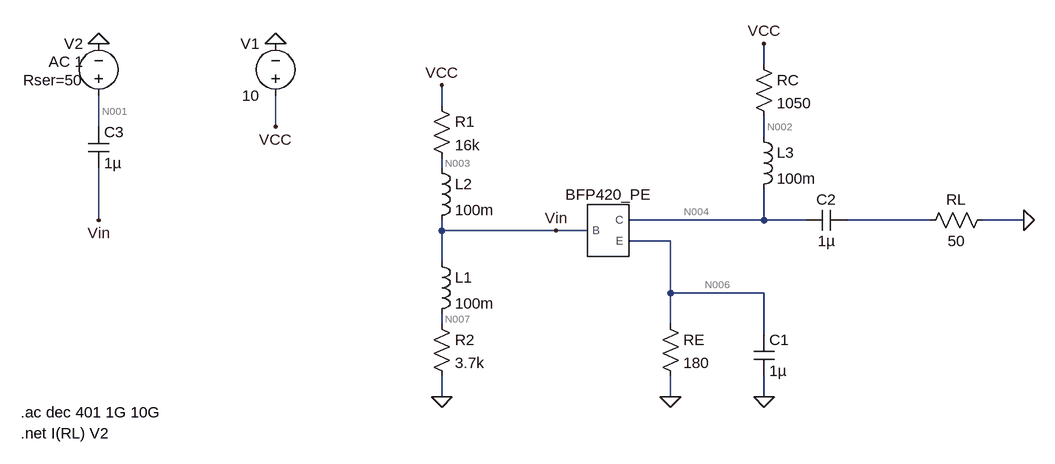
[diagram p0: schematic LNA.asc]
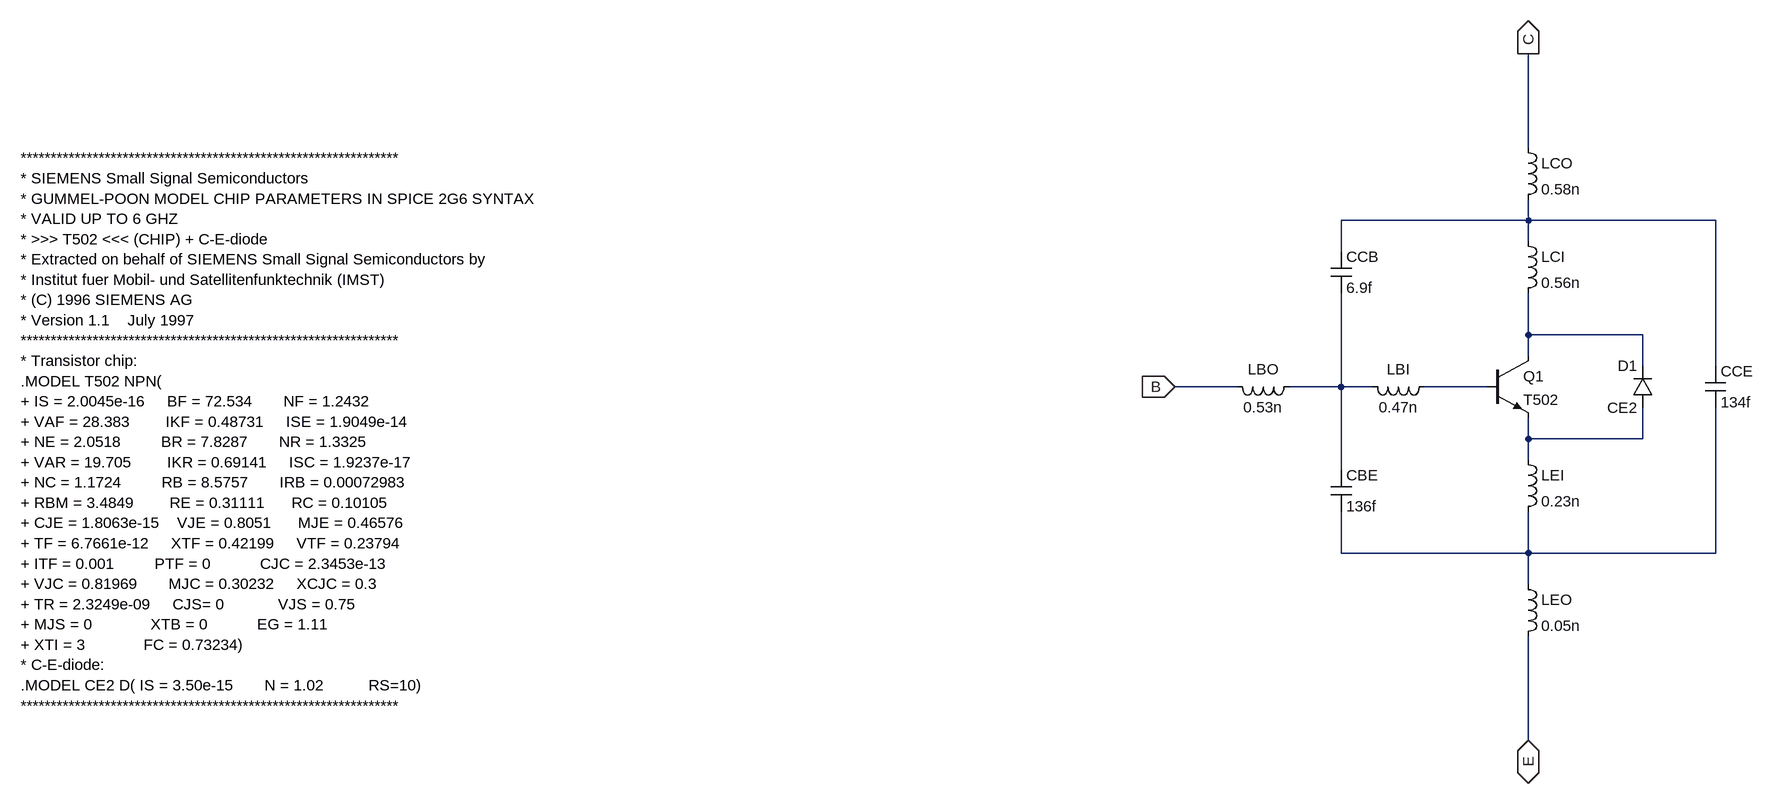
[diagram p1: sub-circuit transistor.asc]
LNA.asc, the LTspice schematic file:
Version 4.1
SHEET 1 1028 680
WIRE 496 -96 496 -128
WIRE 0 -32 0 -64
WIRE -528 0 -528 -48
WIRE -256 0 -256 -48
WIRE 496 16 496 -16
WIRE 0 64 0 48
WIRE -528 144 -528 64
WIRE 496 144 496 96
WIRE 496 144 288 144
WIRE 560 144 496 144
WIRE 752 144 624 144
WIRE 896 144 832 144
WIRE 0 160 0 144
WIRE 176 160 0 160
WIRE 224 160 176 160
WIRE 352 176 288 176
WIRE 0 208 0 160
WIRE 352 256 352 176
WIRE 496 256 352 256
WIRE 0 304 0 288
WIRE 352 304 352 256
WIRE 496 320 496 256
WIRE 0 416 0 384
WIRE 352 416 352 384
WIRE 496 416 496 384
FLAG -256 -128 0
FLAG 0 416 0
FLAG 352 416 0
FLAG -256 0 VCC
FLAG 0 -64 VCC
FLAG 496 -128 VCC
FLAG 496 416 0
FLAG 896 144 0
FLAG -528 -128 0
FLAG -528 144 Vin
FLAG 176 160 Vin
SYMBOL res 480 -112 R0
SYMATTR InstName RC
SYMATTR Value 1050
SYMBOL res 336 288 R0
SYMATTR InstName RE
SYMATTR Value 180
SYMBOL res -16 288 R0
SYMATTR InstName R2
SYMATTR Value 3.7k
SYMBOL res -16 -48 R0
SYMATTR InstName R1
SYMATTR Value 16k
SYMBOL voltage -256 -32 R180
WINDOW 0 24 96 Left 2
WINDOW 3 24 16 Left 2
WINDOW 123 0 0 Left 0
WINDOW 39 0 0 Left 0
SYMATTR InstName V1
SYMATTR Value 10
SYMBOL transistor 256 160 R0
SYMATTR InstName BFP420_PE
SYMBOL cap 480 320 R0
SYMATTR InstName C1
SYMATTR Value 1µ
SYMBOL ind -16 192 R0
SYMATTR InstName L1
SYMATTR Value 100m
SYMBOL ind -16 48 R0
SYMATTR InstName L2
SYMATTR Value 100m
SYMBOL ind 480 0 R0
SYMATTR InstName L3
SYMATTR Value 100m
SYMBOL res 848 128 R90
WINDOW 0 0 56 VBottom 2
WINDOW 3 32 56 VTop 2
SYMATTR InstName RL
SYMATTR Value 50
SYMBOL cap 624 128 R90
WINDOW 0 0 32 VBottom 2
WINDOW 3 32 32 VTop 2
SYMATTR InstName C2
SYMATTR Value 1µ
SYMBOL voltage -528 -32 R180
WINDOW 0 24 96 Left 2
WINDOW 3 24 16 Left 2
WINDOW 123 24 68 Left 2
WINDOW 39 24 40 Left 2
SYMATTR InstName V2
SYMATTR Value ""
SYMATTR Value2 AC 1
SYMATTR SpiceLine Rser=50
SYMBOL cap -544 0 R0
SYMATTR InstName C3
SYMATTR Value 1µ
TEXT -648 440 Left 2 !.ac dec 401 1G 10G
TEXT -648 472 Left 2 !.net I(RL) V2

transistor.asc, the sub-circuit schematic file:
Version 4.1
SHEET 1 2192 680
WIRE 1840 -416 1840 -560
WIRE 1840 -304 1840 -336
WIRE 1840 -304 1552 -304
WIRE 2128 -304 1840 -304
WIRE 1840 -272 1840 -304
WIRE 1552 -256 1552 -304
WIRE 1840 -128 1840 -192
WIRE 2016 -128 1840 -128
WIRE 1840 -96 1840 -128
WIRE 2016 -80 2016 -128
WIRE 2128 -80 2128 -304
WIRE 1392 -48 1296 -48
WIRE 1552 -48 1552 -192
WIRE 1552 -48 1472 -48
WIRE 1600 -48 1552 -48
WIRE 1776 -48 1680 -48
WIRE 1840 32 1840 0
WIRE 2016 32 2016 -16
WIRE 2016 32 1840 32
WIRE 1840 64 1840 32
WIRE 1552 80 1552 -48
WIRE 1552 208 1552 144
WIRE 1840 208 1840 144
WIRE 1840 208 1552 208
WIRE 2128 208 2128 -16
WIRE 2128 208 1840 208
WIRE 1840 256 1840 208
WIRE 1840 496 1840 336
FLAG 1840 496 E
IOPIN 1840 496 BiDir
FLAG 1296 -48 B
IOPIN 1296 -48 In
FLAG 1840 -560 C
IOPIN 1840 -560 Out
SYMBOL npn 1776 -96 R0
SYMATTR InstName Q1
SYMATTR Value T502
SYMBOL ind 1824 48 R0
SYMATTR InstName LEI
SYMATTR Value 0.23n
SYMBOL ind 1824 240 R0
SYMATTR InstName LEO
SYMATTR Value 0.05n
SYMBOL ind 1824 -288 R0
SYMATTR InstName LCI
SYMATTR Value 0.56n
SYMBOL ind 1824 -432 R0
SYMATTR InstName LCO
SYMATTR Value 0.58n
SYMBOL ind 1696 -64 R90
WINDOW 0 5 56 VBottom 2
WINDOW 3 32 56 VTop 2
SYMATTR InstName LBI
SYMATTR Value 0.47n
SYMBOL ind 1488 -64 R90
WINDOW 0 5 56 VBottom 2
WINDOW 3 32 56 VTop 2
SYMATTR InstName LBO
SYMATTR Value 0.53n
SYMBOL cap 2112 -80 R0
SYMATTR InstName CCE
SYMATTR Value 134f
SYMBOL cap 1536 -256 R0
SYMATTR InstName CCB
SYMATTR Value 6.9f
SYMBOL cap 1536 80 R0
SYMATTR InstName CBE
SYMATTR Value 136f
SYMBOL diode 2032 -16 R180
WINDOW 0 24 64 Left 2
WINDOW 3 24 0 Left 2
SYMATTR InstName D1
SYMATTR Value CE2
TEXT -480 -400 Left 2 !***************************************************************\n* SIEMENS Small Signal Semiconductors\n* GUMMEL-POON MODEL CHIP PARAMETERS IN SPICE 2G6 SYNTAX\n* VALID UP TO 6 GHZ\n* >>> T502 <<< (CHIP) + C-E-diode\n* Extracted on behalf of SIEMENS Small Signal Semiconductors by\n* Institut fuer Mobil- und Satellitenfunktechnik (IMST)\n* (C) 1996 SIEMENS AG\n* Version 1.1    July 1997\n***************************************************************\n* Transistor chip:\n.MODEL T502 NPN(\n+ IS = 2.0045e-16     BF = 72.534       NF = 1.2432\n+ VAF = 28.383        IKF = 0.48731     ISE = 1.9049e-14\n+ NE = 2.0518         BR = 7.8287       NR = 1.3325\n+ VAR = 19.705        IKR = 0.69141     ISC = 1.9237e-17\n+ NC = 1.1724         RB = 8.5757       IRB = 0.00072983\n+ RBM = 3.4849        RE = 0.31111      RC = 0.10105\n+ CJE = 1.8063e-15    VJE = 0.8051      MJE = 0.46576\n+ TF = 6.7661e-12     XTF = 0.42199     VTF = 0.23794\n+ ITF = 0.001         PTF = 0           CJC = 2.3453e-13\n+ VJC = 0.81969       MJC = 0.30232     XCJC = 0.3\n+ TR = 2.3249e-09     CJS= 0            VJS = 0.75\n+ MJS = 0             XTB = 0           EG = 1.11\n+ XTI = 3             FC = 0.73234)\n* C-E-diode:\n.MODEL CE2 D( IS = 3.50e-15       N = 1.02          RS=10)\n***************************************************************

The netlist it stands for:
* LNA.asc
RC VCC N002 1050
RE N006 0 180
R2 N007 0 3.7k
R1 VCC N003 16k
V1 VCC 0 10
X§BFP420_PE Vin N004 N006 transistor
C1 N006 0 1µ
L1 Vin N007 100m
L2 N003 Vin 100m
L3 N002 N004 100m
RL 0 N005 50
C2 N005 N004 1µ
V2 N001 0 AC 1 Rser=50
C3 N001 Vin 1µ

* block symbol definitions
.subckt transistor B C E
Q1 N002 N004 N005 0 T502
LEI N005 N006 0.23n
LEO N006 E 0.05n
LCI N001 N002 0.56n
LCO C N001 0.58n
LBI N004 N003 0.47n
LBO N003 B 0.53n
CCE N001 N006 134f
CCB N001 N003 6.9f
CBE N003 N006 136f
D1 N005 N002 CE2
***************************************************************
* SIEMENS Small Signal Semiconductors
* GUMMEL-POON MODEL CHIP PARAMETERS IN SPICE 2G6 SYNTAX
* VALID UP TO 6 GHZ
* >>> T502 <<< (CHIP) + C-E-diode
* Extracted on behalf of SIEMENS Small Signal Semiconductors by
* Institut fuer Mobil- und Satellitenfunktechnik (IMST)
* (C) 1996 SIEMENS AG
* Version 1.1    July 1997
***************************************************************
* Transistor chip:
.MODEL T502 NPN(
+ IS = 2.0045e-16     BF = 72.534       NF = 1.2432
+ VAF = 28.383        IKF = 0.48731     ISE = 1.9049e-14
+ NE = 2.0518         BR = 7.8287       NR = 1.3325
+ VAR = 19.705        IKR = 0.69141     ISC = 1.9237e-17
+ NC = 1.1724         RB = 8.5757       IRB = 0.00072983
+ RBM = 3.4849        RE = 0.31111      RC = 0.10105
+ CJE = 1.8063e-15    VJE = 0.8051      MJE = 0.46576
+ TF = 6.7661e-12     XTF = 0.42199     VTF = 0.23794
+ ITF = 0.001         PTF = 0           CJC = 2.3453e-13
+ VJC = 0.81969       MJC = 0.30232     XCJC = 0.3
+ TR = 2.3249e-09     CJS= 0            VJS = 0.75
+ MJS = 0             XTB = 0           EG = 1.11
+ XTI = 3             FC = 0.73234)
* C-E-diode:
.MODEL CE2 D( IS = 3.50e-15       N = 1.02          RS=10)
***************************************************************
.ends transistor

.model D D
.lib standard.dio
.model NPN NPN
.model PNP PNP
.lib standard.bjt
.ac dec 401 1G 10G
.net I(RL) V2
.backanno
.end

* Results of the author's LTspice run, read from the files saved beside the schematic
* Operating Point, zero values left out:
*   V(n002) = 5.773 V
*   V(n003) = 1.718 V
*   V(n004) = 5.773 V
*   V(n006) = 734.2 mV
*   V(n007) = 1.718 V
*   V(vcc) = 10 V
*   V(vin) = 1.718 V
*   I(L1) = 464.4 µA
*   I(L2) = 517.6 µA
*   I(L3) = 4.025 mA
*   I(R1) = 517.6 µA
*   I(R2) = 464.4 µA
*   I(RC) = 4.025 mA
*   I(RE) = 4.079 mA
*   I(V1) = -4.543 mA
*   Ix(bfp420_pe:b) = 53.24 µA
*   Ix(bfp420_pe:c) = 4.025 mA
*   Ix(bfp420_pe:e) = -4.079 mA
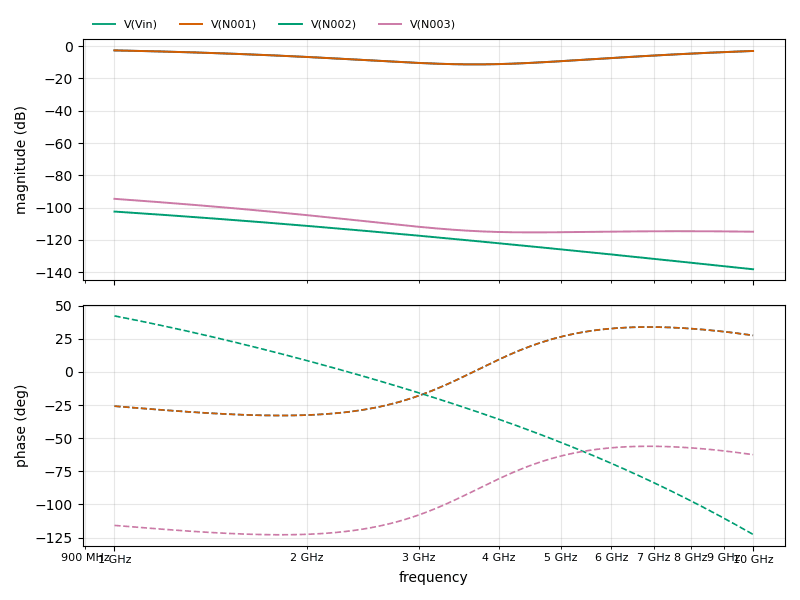
[diagram p2: AC Analysis of LNA.asc, plotted from the saved traces]
* AC Analysis, 1 run:
*   V(Vin): -2.66 dB at 1 GHz, -3.02 dB at 10 GHz, peak -2.66 dB at 1 GHz, 3 dB below the peak at 1.753 GHz
*   V(N001): -2.66 dB at 1 GHz, -3.02 dB at 10 GHz, peak -2.66 dB at 1 GHz, 3 dB below the peak at 1.753 GHz
*   V(N002): -102.42 dB at 1 GHz, -138.14 dB at 10 GHz, peak -102.42 dB at 1 GHz, 3 dB below the peak at 1.29 GHz
*   V(N003): -94.55 dB at 1 GHz, -114.91 dB at 10 GHz, peak -94.55 dB at 1 GHz, 3 dB below the peak at 1.263 GHz